# EAGLE design tricorder-featherwing-mk-1.6 (EAGLE 7.5.0)
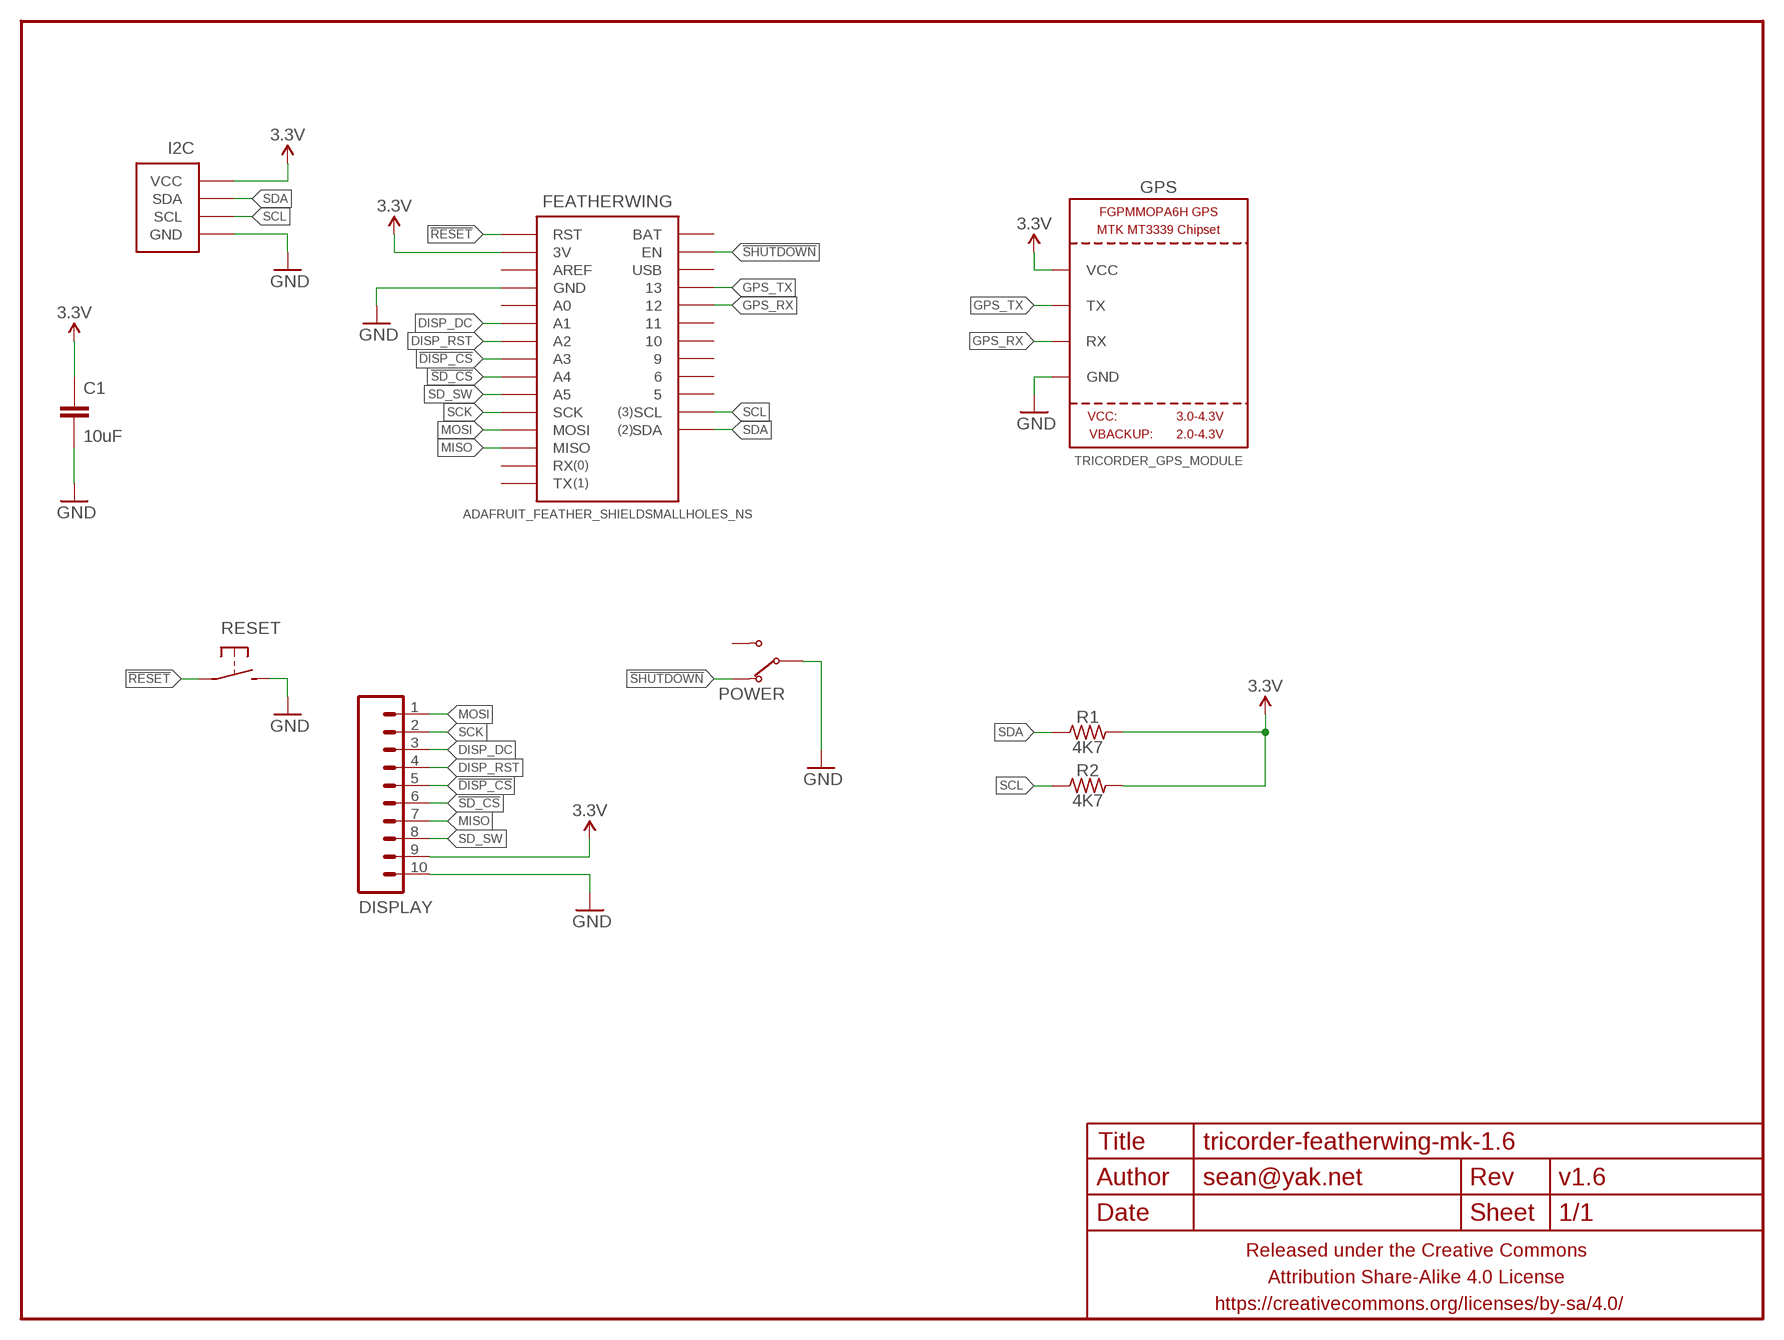
[diagram p0: schematic, sheet 1]

## Parts
C1  10uF  CAPACITOR-CERAMICC1210  [C1210]
DISPLAY  M102MM  [1X10-2MM]
FEATHERWING  ADAFRUIT_FEATHER_SHIELDSMALLHOLES_NS  [ADAFRUIT_FEATHER_SMALLHOLES_NS]
FRAME1  FRAME-LETTERNO_PACKAGE  [DUMMY]
GPS  TRICORDER_GPS_MODULE  [TRICORDER_GPS_MODULE]
I2C  M04-I2CPTH-2MM-CENTERED  [1X04-2MM-CENTERED-I2C]
POWER  SWITCH-SPDTPTH-RA-2.54MM-CENTERED  [SPDT-RA-2.54MM-CENTERED]
R1  4K7  RESISTORR0603  [R0603]
R2  4K7  RESISTORR0603  [R0603]
RESET  SPST-NO-TACTCK-PTS840-GK  [TACTILE-SMD-CK-PTS840-GK]

## Nets
3.3V: C1.1 DISPLAY.9 FEATHERWING.3V GPS.VCC I2C.2(VCC) R1.2 R2.2
!DISP_CS: DISPLAY.5 FEATHERWING.A3
!RESET: FEATHERWING.RST RESET.1 RESET.2
!SD_CS: DISPLAY.6 FEATHERWING.A4
!SHUTDOWN: FEATHERWING.EN POWER.1(NC)
DISP_DC: DISPLAY.3 FEATHERWING.A1
DISP_RST: DISPLAY.4 FEATHERWING.A2
GND: C1.2 DISPLAY.10 FEATHERWING.GND@0(GND) FEATHERWING.GND@1(GND) GPS.GND@1(GND) GPS.GND@2(GND) I2C.1(GND) POWER.2(COM) RESET.3 RESET.4
GPS_RX: FEATHERWING.12 GPS.RX
GPS_TX: FEATHERWING.13 GPS.TX
MISO: DISPLAY.7 FEATHERWING.MISO
MOSI: DISPLAY.1 FEATHERWING.MOSI
SCK: DISPLAY.2 FEATHERWING.SCK
SCL: FEATHERWING.SCL I2C.4(SCL) R2.1
SD_SW: DISPLAY.8 FEATHERWING.A5
SDA: FEATHERWING.SDA I2C.3(SDA) R1.1
Unconnected: FEATHERWING.5 FEATHERWING.6 FEATHERWING.9 FEATHERWING.10 FEATHERWING.11 FEATHERWING.A0 FEATHERWING.AREF FEATHERWING.BAT FEATHERWING.RX FEATHERWING.TX FEATHERWING.USB POWER.3(NO)

## Library data of the parts
C1 = a_parts:CAPACITOR-CERAMIC: CAPACITOR, European symbol
DISPLAY = a_parts:M10: Header 10 Standard 10-pin 0.1" header. Use with straight break away headers (SKU : PRT-00116), right angle break away headers (PRT-00553), swiss pins (PRT-00743), machine pins (PRT-00117), and female headers (PRT-00115).
FEATHERWING = a_parts:ADAFRUIT_FEATHER_SHIELD
FRAME1 = a_parts:FRAME-LETTER: Schematic Frame Standard 8.5x11 US Letter frame; DESIGNER: sean@yak.net; VERSION: v1.6
GPS = a_parts:TRICORDER_GPS_MODULE
I2C = a_parts:M04-I2C
POWER = a_parts:SWITCH-SPDT
R1 R2 = a_parts:RESISTOR: RESISTOR, American symbol
RESET = a_parts:SPST-NO-TACT

## Board
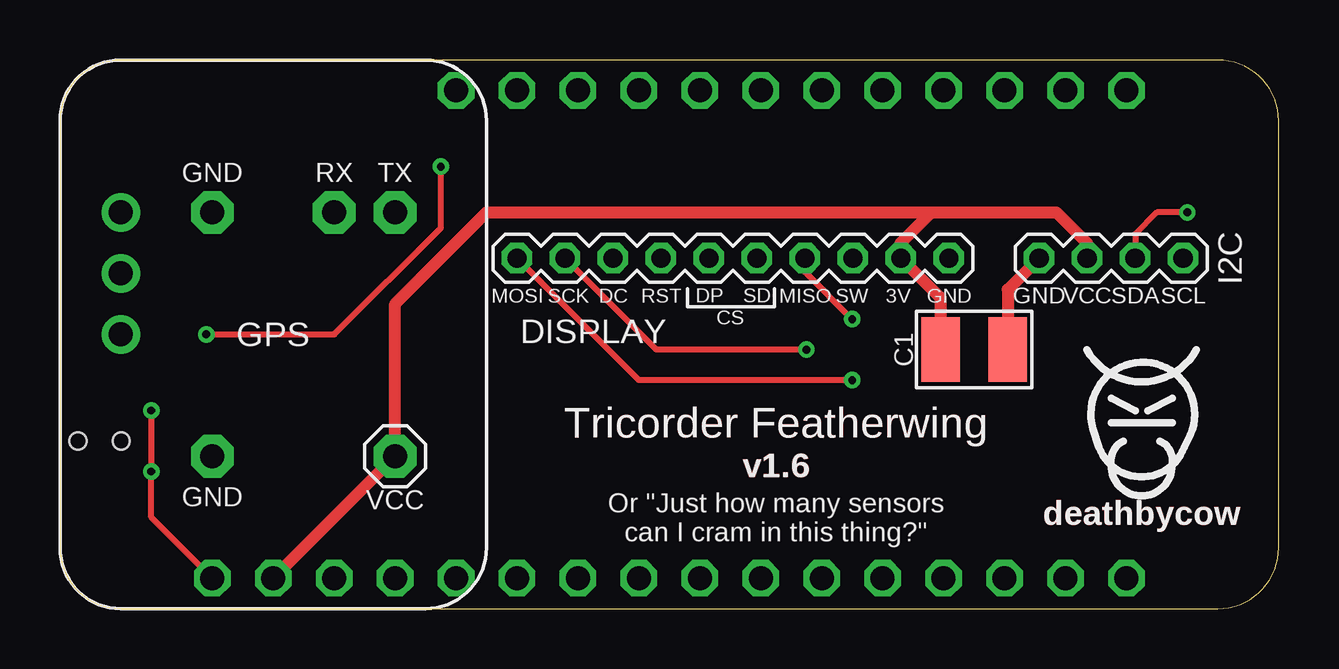
[diagram p1: board, top side]
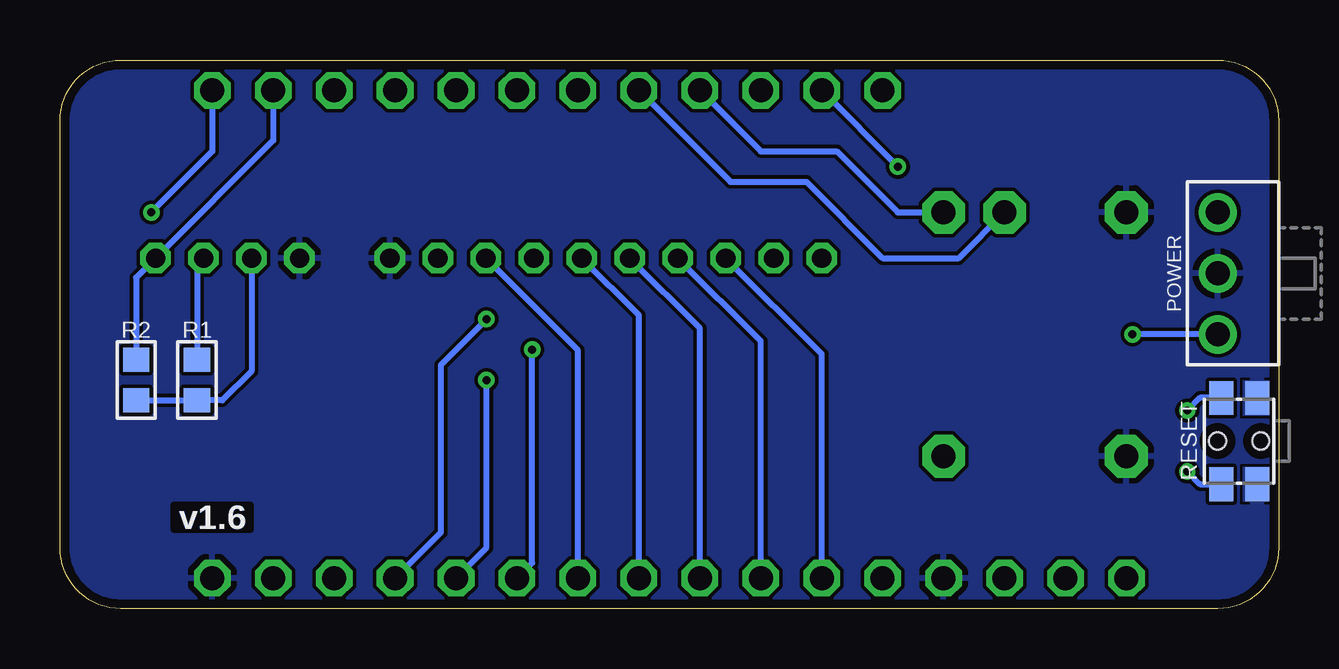
[diagram p2: board, bottom side, seen from below]

Size 50.8 x 22.86 mm. Coordinates in mm from the lower left corner, seen from the top.
Outline: 2.54,0 48.26,0 arc90 50.8,2.54 50.8,20.32 arc90 48.26,22.86 2.54,22.86 arc90 0,20.32 0,2.54 arc90 2.54,0
Copper layers (1*16): Top 0.0356mm / dielectric 1.5011mm / Bottom 0.0356mm
Design rules "LaenPCBOrder2": minimum track width 6mil, minimum drill 13mil, track to track 6mil, track to pad 6mil, pad to pad 6mil, via to via 6mil, smd to smd 6mil, copper to edge 15mil, drill to drill 6mil, minimum pad ring 7mil, minimum via ring 7mil, stop-mask expansion 3mil, vias tented up to drill 20mil, thermal gap 10mil

### Footprints (pad centres in the part's own frame; a part is rotated, then mirrored left to right if it is on the bottom)
C1210 = smd 1.6 x 2.7: 1 -1.4,0; 2 1.4,0
1X10-2MM = drill 0.8 pad 1.27 octagon: 1 0,0; 2 2,0; 3 4,0; 4 6,0; 5 8,0; 6 10,0; 7 12,0; 8 14,0; 9 16,0; 10 18,0
ADAFRUIT_FEATHER_SMALLHOLES_NS = drill 1 pad 1.524 octagon: 3V -16.51,-10.16; 5 13.97,10.16; 6 11.43,10.16; 9 8.89,10.16; 10 6.35,10.16; 11 3.81,10.16; 12 1.27,10.16; 13 -1.27,10.16; A0 -8.89,-10.16; A1 -6.35,-10.16; A2 -3.81,-10.16; A3 -1.27,-10.16; A4 1.27,-10.16; A5 3.81,-10.16; AREF -13.97,-10.16; BAT -8.89,10.16; EN -6.35,10.16; GND@0 -11.43,-10.16; GND@1 19.05,-10.16; MISO 11.43,-10.16; MOSI 8.89,-10.16; RST -19.05,-10.16; RX 13.97,-10.16; SCK 6.35,-10.16; SCL 16.51,10.16; SDA 19.05,10.16; TX 16.51,-10.16; USB -3.81,10.16
TRICORDER_GPS_MODULE = drill 1 pad 1.778 octagon: GND@1 -2.54,-5.08; GND@2 -2.54,5.08; RX 2.54,5.08; TX 5.08,5.08; VCC 5.08,-5.08
1X04-2MM-CENTERED-I2C = drill 0.8 pad 1.27 octagon: 1 -3,0; 2 -1,0; 3 1,0; 4 3,0
SPDT-RA-2.54MM-CENTERED = drill 1 pad 1.6: 1 -2.54,0; 2 0,0; 3 2.54,0
R0603 = smd 1 x 1.1: 1 -0.85,0; 2 0.85,0
TACTILE-SMD-CK-PTS840-GK = smd 1.4 x 1: 1 -1.8,0.75; 2 1.8,0.75; 3 -1.8,-0.75; 4 1.8,-0.75 | hole 0.7: 0,-0.9; 0,0.9

### Placement (x,y rotation side)
C1  38.1,10.79 0 top
DISPLAY  19.05,14.61 0 top
FEATHERWING  25.4,11.43 0 top
FRAME1  0,0 0 top
GPS  8.89,11.43 0 top
I2C  43.81,14.61 0 top
POWER  2.54,13.97 90 bottom
R1  45.09,9.53 270 bottom
R2  47.62,9.53 270 bottom
RESET  1.65,6.99 90 bottom
U$2  [COW_SMALL_METAL]  45.09,8.26 0 top

### Tracks (layer width: path | path; a pad name or v marks a point on that pad's centre or on a via)
3.3V
  Top 0.508: C1.1 36.7,12.96 DISPLAY.9 35.05,15.24 36.32,16.51 | 36.32,16.51 41.53,16.51 42.81,15.22 I2C.2 | FEATHERWING.3V GPS.VCC 13.97,12.7 17.78,16.51 36.32,16.51
  Bottom 0.254: I2C.2 42.81,9.89 44.03,8.68 R1.2 R2.2
!DISP_CS
  Bottom 0.254: FEATHERWING.A3 24.13,11.69 DISPLAY.5
!RESET  (via drill 0.33)
  Top 0.254: v3.81,8.26 v3.81,5.71 3.81,3.81 FEATHERWING.RST
  Bottom 0.254: RESET.2 3.28,8.79 v3.81,8.26 | v3.81,5.71 3.28,5.18 RESET.1
!SD_CS
  Bottom 0.254: FEATHERWING.A4 26.67,12.22 DISPLAY.6
!SHUTDOWN  (via drill 0.33)
  Top 0.254: v6.1,11.43 11.43,11.43 15.88,15.88 v15.88,18.41
  Bottom 0.254: v15.88,18.41 FEATHERWING.EN | POWER.1 v6.1,11.43
DISP_DC
  Bottom 0.254: FEATHERWING.A1 19.05,10.61 DISPLAY.3
DISP_RST
  Bottom 0.254: FEATHERWING.A2 21.59,11.14 DISPLAY.4
GND
  Top 0.508: I2C.1 39.5,13.29 C1.2
  pour Bottom: 2.54,0 48.26,0 arc90 50.8,2.54 50.8,20.32 arc90 48.26,22.86 2.54,22.86 arc90 0,20.32 0,2.54 arc90
GPS_RX
  Bottom 0.254: FEATHERWING.12 22.86,17.78 19.68,17.78 16.51,14.61 13.34,14.61 GPS.RX
GPS_TX
  Bottom 0.254: FEATHERWING.13 21.59,19.05 18.41,19.05 15.88,16.51 GPS.TX
MISO  (via drill 0.33)
  Top 0.254: v33.02,12.06 31.05,14.04 DISPLAY.7
  Bottom 0.254: FEATHERWING.MISO 34.92,3.17 34.92,10.16 v33.02,12.06
MOSI  (via drill 0.33)
  Top 0.254: v33.02,9.53 24.13,9.53 DISPLAY.1
  Bottom 0.254: FEATHERWING.MOSI 33.02,2.54 v33.02,9.53
SCK  (via drill 0.33)
  Top 0.254: v31.11,10.79 24.86,10.79 DISPLAY.2
  Bottom 0.254: FEATHERWING.SCK 31.11,1.91 v31.11,10.79
SCL
  Bottom 0.254: R2.1 47.62,13.79 I2C.4 41.91,19.51 FEATHERWING.SCL
SD_SW
  Bottom 0.254: FEATHERWING.A5 29.21,10.77 DISPLAY.8
SDA  (via drill 0.33)
  Top 0.254: v46.99,16.51 45.72,16.51 44.81,15.61 I2C.3
  Bottom 0.254: I2C.3 45.09,14.34 R1.1 | FEATHERWING.SDA 44.45,19.05 v46.99,16.51

### Text on the board
Top: Tricorder Featherwing
tPlace: MOSI | SCK | DC | RST | DP | SD | MISO | SW | 3V | GND | CS | Tricorder Featherwing | Or "Just how many sensors / can I cram in this thing?"